# Altium schematic sheet 09.SchDoc
size 297 x 209 mm
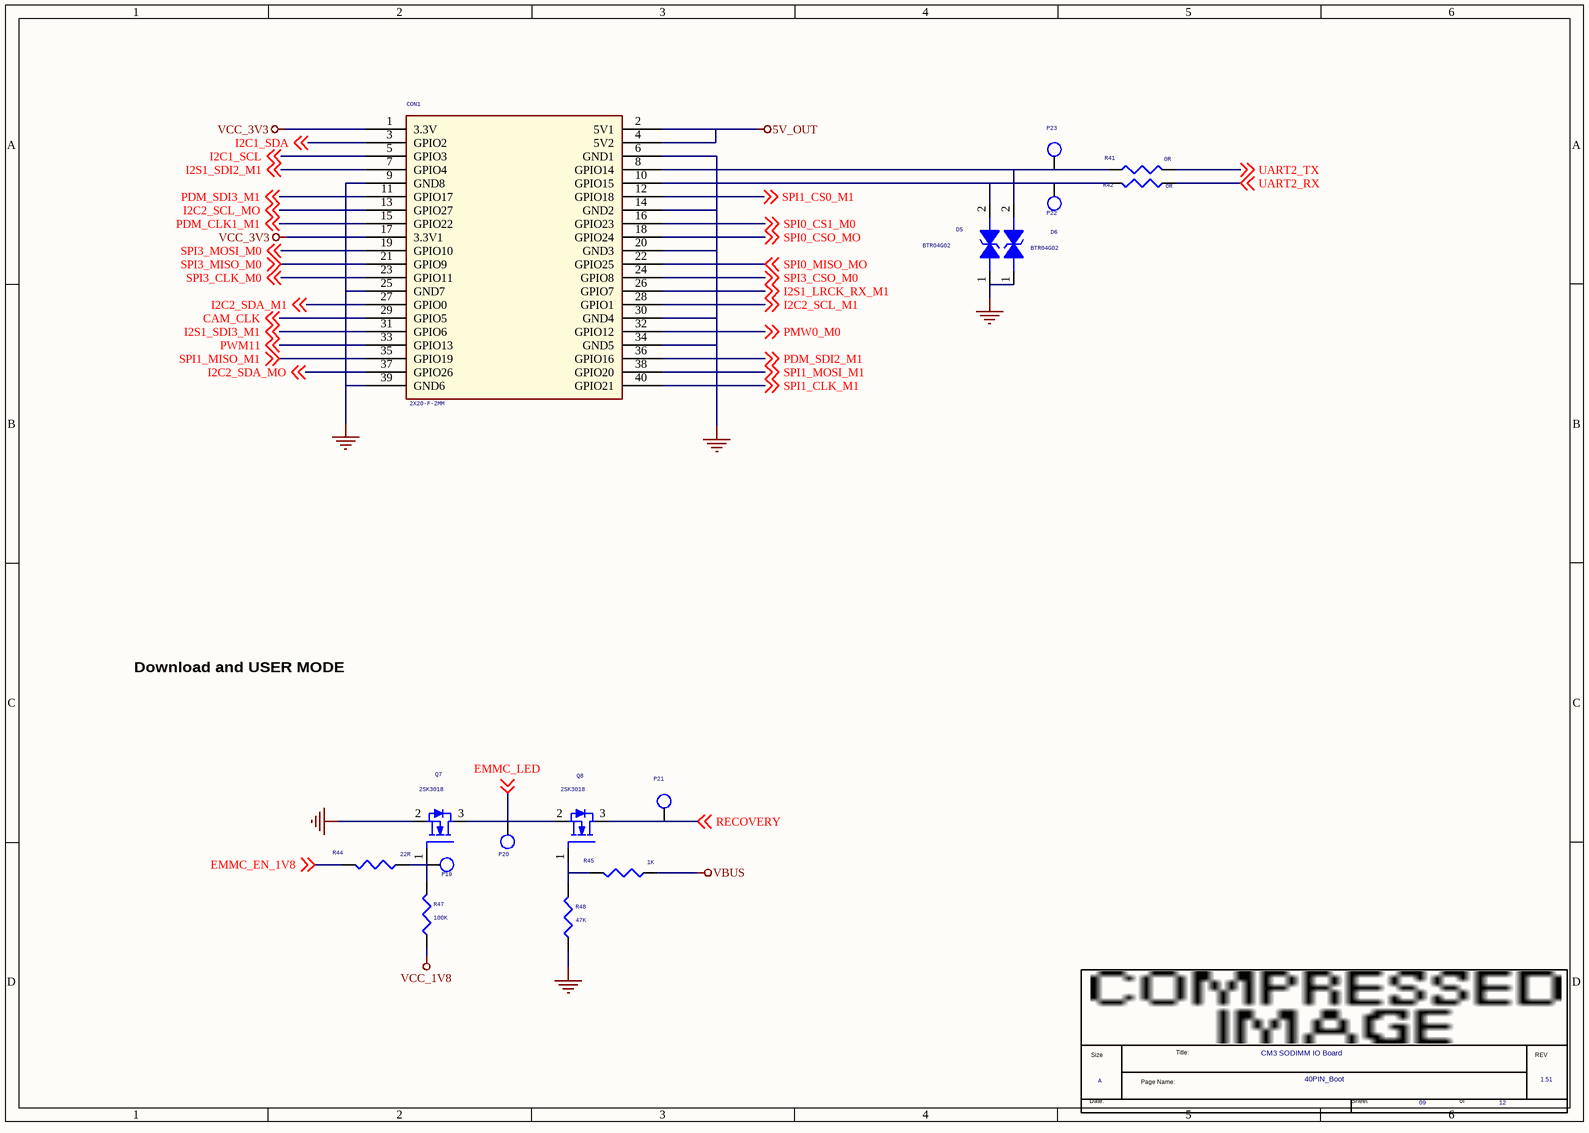
[diagram p0: 09.SchDoc]

## Parts
*  Page Count: 12  Page Number: 09  Page Size: A  Title: CM3 SODIMM IO Board  RevCode: 1.51  Doc: 40PIN_Boot  (hidden comment: radxa_1010)  (graphical)
CON1  2X20-F-2MM  [DIP40PIN_2D54MM]
D5  BTR04G02  [ESD0402_1xD5]
D6  BTR04G02  [ESD0402_1xD5]
P19  TEST  [TEST]  (value not drawn)
P20  TEST  [TEST]  (value not drawn)
P21  TEST  [TEST]  (value not drawn)
P22  TEST  [TEST]  (value not drawn)
P23  TEST  [TEST]  (value not drawn)
Q7  2SK3018  [SOT23]
Q8  2SK3018  [SOT23]
R41  0R  [R0402]
R42  0R  [R0402]
R44  22R  [R0402]
R45  1K  [R0402]
R47  100K  [R0402]
R48  47K  [R0402]

## Nets
5V_OUT: CON1.2(5V1) CON1.4(5V2)
GND: CON1.6(GND1) CON1.9(GND8) CON1.14(GND2) CON1.20(GND3) CON1.25(GND7) CON1.30(GND4) CON1.34(GND5) CON1.39(GND6) D5.1 D6.1 Q7.2(SOURCE) R48.2
VBUS: R45.2
VCC_1V8: R47.2
VCC_3V3: CON1.1(3.3V) CON1.17(3.3V1)
CAM_CLK: CON1.29(GPIO5) ; off-sheet CAM_CLK
EMMC_EN_1V8: R44.1 ; off-sheet EMMC_EN_1V8
EMMC_LED: P20.1 Q7.3(DRAIN) Q8.2(SOURCE) ; off-sheet EMMC_LED
I2C1_SCL: CON1.5(GPIO3) ; off-sheet I2C1_SCL
I2C1_SDA: CON1.3(GPIO2) ; off-sheet I2C1_SDA
I2C2_SCL_M1: CON1.28(GPIO1) ; off-sheet I2C2_SCL_M1
I2C2_SCL_MO: CON1.13(GPIO27) ; off-sheet I2C2_SCL_MO
I2C2_SDA_M1: CON1.27(GPIO0) ; off-sheet I2C2_SDA_M1
I2C2_SDA_MO: CON1.37(GPIO26) ; off-sheet I2C2_SDA_MO
I2S1_LRCK_RX_M1: CON1.26(GPIO7) ; off-sheet I2S1_LRCK_RX_M1
I2S1_SDI2_M1: CON1.7(GPIO4) ; off-sheet I2S1_SDI2_M1
I2S1_SDI3_M1: CON1.31(GPIO6) ; off-sheet I2S1_SDI3_M1
PDM_CLK1_M1: CON1.15(GPIO22) ; off-sheet PDM_CLK1_M1
PDM_SDI2_M1: CON1.36(GPIO16) ; off-sheet PDM_SDI2_M1
PDM_SDI3_M1: CON1.11(GPIO17) ; off-sheet PDM_SDI3_M1
PMW0_M0: CON1.32(GPIO12) ; off-sheet PMW0_M0
PWM11: CON1.33(GPIO13) ; off-sheet PWM11
RECOVERY: P21.1 Q8.3(DRAIN) ; off-sheet RECOVERY
SPI0_CS1_M0: CON1.16(GPIO23) ; off-sheet SPI0_CS1_M0
SPI0_CSO_MO: CON1.18(GPIO24) ; off-sheet SPI0_CSO_MO
SPI0_MISO_MO: CON1.22(GPIO25) ; off-sheet SPI0_MISO_MO
SPI1_CLK_M1: CON1.40(GPIO21) ; off-sheet SPI1_CLK_M1
SPI1_CS0_M1: CON1.12(GPIO18) ; off-sheet SPI1_CS0_M1
SPI1_MISO_M1: CON1.35(GPIO19) ; off-sheet SPI1_MISO_M1
SPI1_MOSI_M1: CON1.38(GPIO20) ; off-sheet SPI1_MOSI_M1
SPI3_CLK_M0: CON1.23(GPIO11) ; off-sheet SPI3_CLK_M0
SPI3_CSO_M0: CON1.24(GPIO8) ; off-sheet SPI3_CSO_M0
SPI3_MISO_M0: CON1.21(GPIO9) ; off-sheet SPI3_MISO_M0
SPI3_MOSI_M0: CON1.19(GPIO10) ; off-sheet SPI3_MOSI_M0
UART2_RX: R42.2 ; off-sheet UART2_RX
UART2_TX: R41.2 ; off-sheet UART2_TX
NetCON1_8: CON1.8(GPIO14) D6.2 P23.1 R41.1
NetCON1_10: CON1.10(GPIO15) D5.2 P22.1 R42.1
NetP19_1: P19.1 Q7.1(GATE) R44.2 R47.1
NetQ8_1: Q8.1(GATE) R45.1 R48.1

## Notes on the sheet
- Download and USER MODE
- (in symbol radxa_1010) Size; Title:; REV; Page Name:; Date:; Sheet; of

## Library data of the parts
CON1 = CN_6
D5 = DIODE BI_DIR TRIG: 1-Line, Bi-directional, Transient Voltage Suppressors.17.5pF.; Manufacturer: WillSemi(韦尔半导体); RK PN: ESD5451N; Priority: A; OPTION: DNP; Part Type: ESD_TVS; Manufacturer PN: ESD5451N; Created by: JJJ
D6 = DIODE BI_DIR TRIG: 1-Line, Bi-directional, Transient Voltage Suppressors.17.5pF.; Manufacturer PN: ESD5451N; Manufacturer: WillSemi(韦尔半导体); OPTION: DNP; Priority: A; Created by: JJJ; Part Type: ESD_TVS; RK PN: ESD5451N
P19-P23 = TESTPOINT1
Q7 = MOSFET N: NMOS,2SK3018,SOT_323,Id=0.1A,Vds=30V; Manufacturer: ROHM; Pd: 0.2W; Vgsth: 1.5V; VDS: 30V; Vgs: 20V; Id_max: 0.1A; Priority: A; Rds: 5ohm; Created by: JJJ; Manufacturer PN: 2SK3018; Part Type: NMOS; RK PN: 2SK3018
Q8 = MOSFET N: NMOS,2SK3018,SOT_323,Id=0.1A,Vds=30V; Manufacturer: ROHM; Rds: 5ohm; Priority: A; Id_max: 0.1A; Vgs: 20V; VDS: 30V; Vgsth: 1.5V; Pd: 0.2W; RK PN: 2SK3018; Part Type: NMOS; Manufacturer PN: 2SK3018; Created by: JJJ
R41 = RESISTOR_0: 通用厚膜电阻,0R,+/-5%,R0402,1/16W.; Manufacturer: YAGEO; Tolerance: 5%; RK PN: RC0402JR-070RL; Priority: A; Wattage: 1/16W; Part Type: 通用厚膜电阻; Manufacturer PN: RC0402JR-070RL; Created by: YTL
R42 = RESISTOR_0: 通用厚膜电阻,0R,+/-5%,R0402,1/16W.; Manufacturer PN: RC0402JR-070RL; Manufacturer: YAGEO; Tolerance: 5%; Wattage: 1/16W; Priority: A; Created by: YTL; Part Type: 通用厚膜电阻; RK PN: RC0402JR-070RL
R44 R45 = RESISTOR_2: 通用厚膜电阻,330R,+/-5%,R0402,1/16W.; Manufacturer PN: RC0402JR-07330RL; Manufacturer: YAGEO; Tolerance: 5%; Wattage: 1/16W; Priority: A; Created by: YTL; Part Type: 通用厚膜电阻; RK PN: RC0402JR-07330RL
R47 = RESISTOR_0: 通用厚膜电阻,10K,+/-5%,R0402,1/16W.; Manufacturer: YAGEO; Tolerance: 5%; RK PN: RC0402JR-0710KL; Priority: A; Wattage: 1/16W; Part Type: 通用厚膜电阻; Manufacturer PN: RC0402JR-0710KL; Created by: YTL
R48 = RESISTOR_0: 通用厚膜电阻,10K,+/-5%,R0402,1/16W.; Manufacturer PN: RC0402JR-0710KL; Manufacturer: YAGEO; Tolerance: 5%; Wattage: 1/16W; Priority: A; Created by: YTL; Part Type: 通用厚膜电阻; RK PN: RC0402JR-0710KL
* = radxa_1010: Page Create Date: March  8, 1995